# EAGLE design Qwiic_keypad (EAGLE 9.2.2)
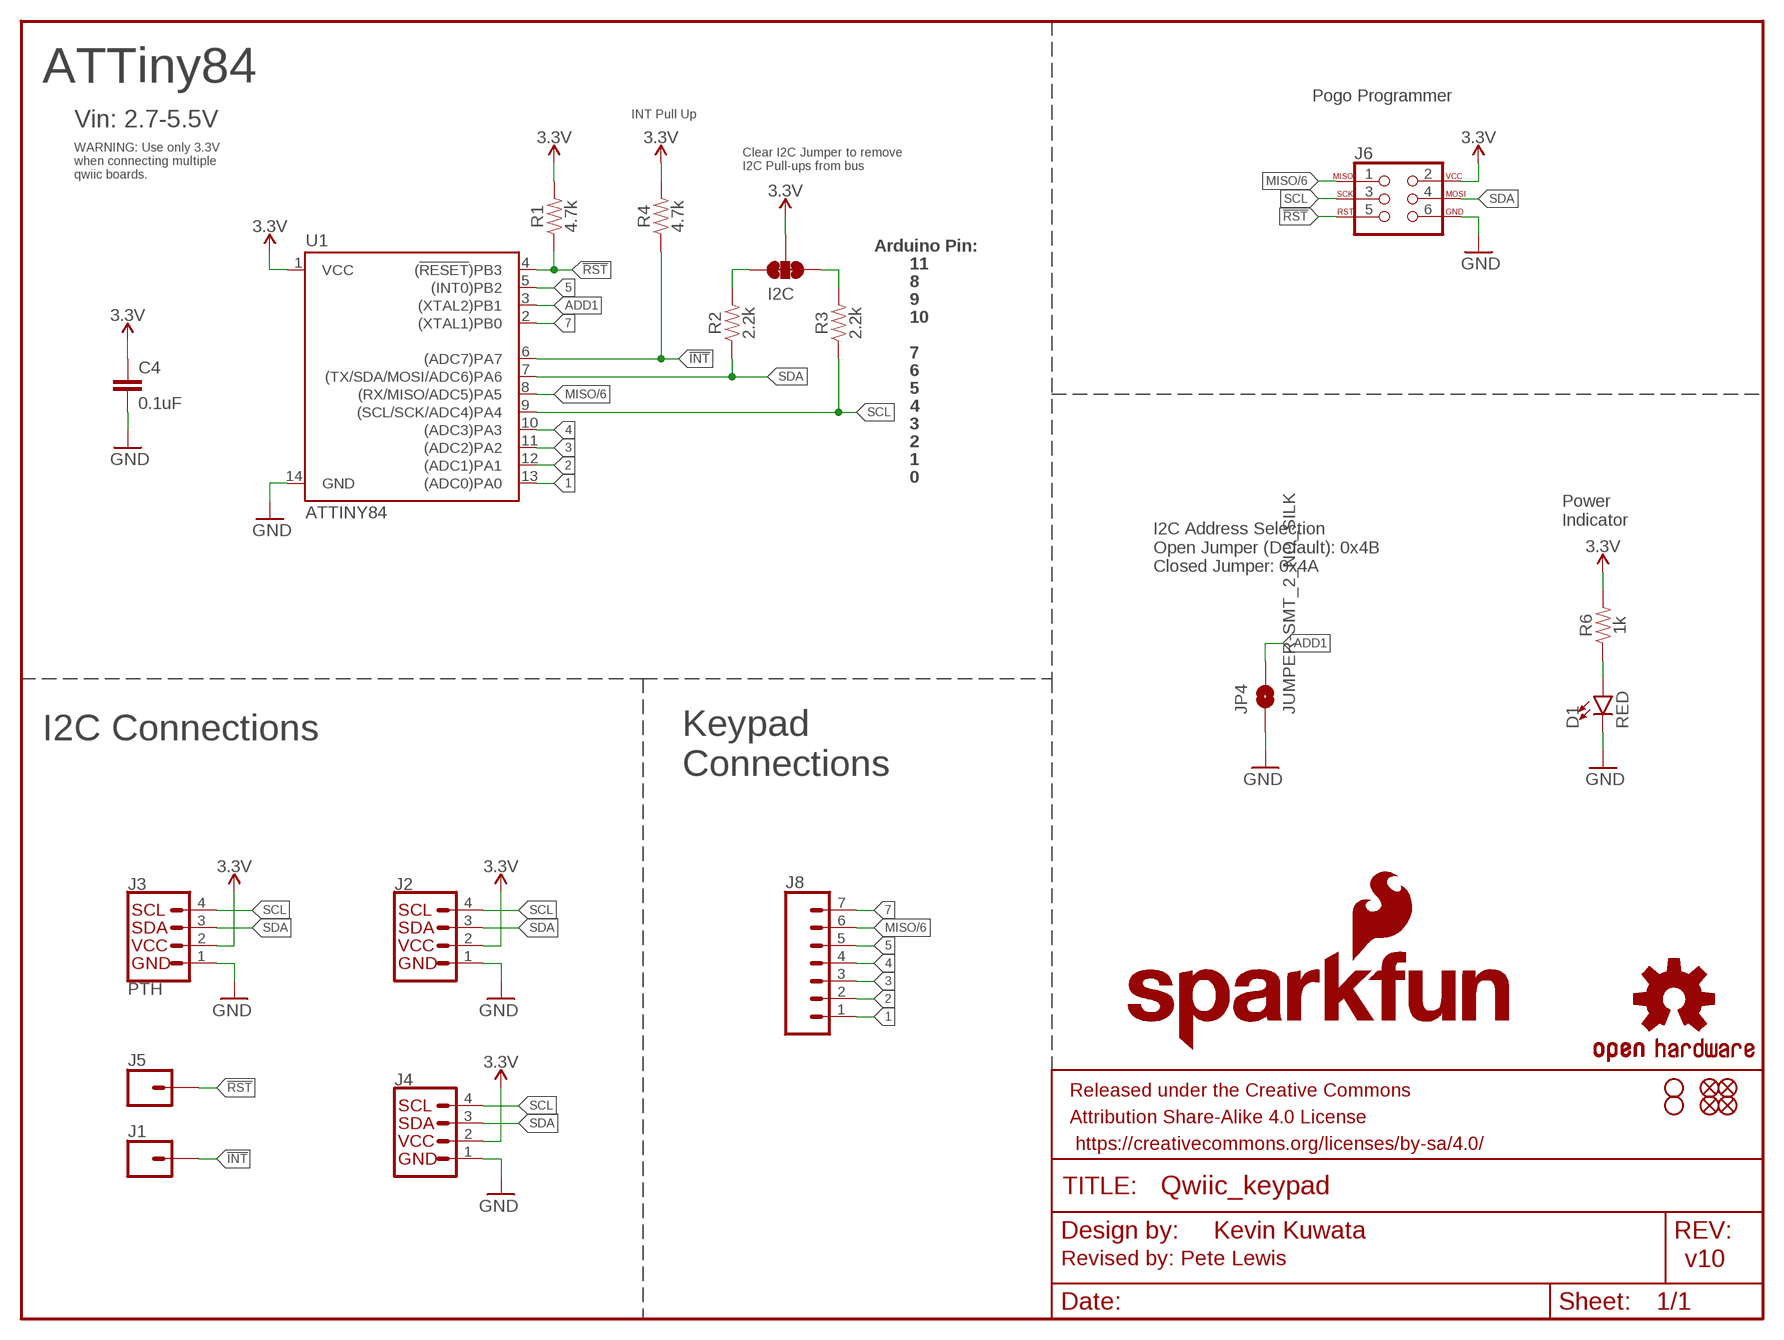
[diagram p0: schematic, sheet 1]

## Parts
C4  0.1uF  0.1UF-0603-25V-(+80/-20%)  [0603]
D1  RED  LED-RED0603  [LED-0603]
FRAME1  FRAME-LETTER  [CREATIVE_COMMONS]
H1  STAND-OFF  [STAND-OFF]
H2  STAND-OFF  [STAND-OFF]
I2C  JUMPER-SMT_3_2-NC_TRACE_SILK  [SMT-JUMPER_3_2-NC_TRACE_SILK]
J1  CONN_01PTH_NO_SILK_YES_STOP  [1X01_NO_SILK]
J2  QWIIC_CONNECTORJS-1MM  [JST04_1MM_RA]
J3  PTH  I2C_STANDARD_NO_SILK  [1X04_NO_SILK]
J4  QWIIC_CONNECTORJS-1MM  [JST04_1MM_RA]
J5  CONN_01PTH_NO_SILK_YES_STOP  [1X01_NO_SILK]
J6  AVR_SPI_PROG_3X2TESTPOINTS  [2X3_TEST_POINTS]
J8  CONN_07LOCK_NO_SILK  [1X07_LOCK_NO_SILK]
JP1  FIDUCIALUFIDUCIAL  [MICRO-FIDUCIAL]
JP2  FIDUCIALUFIDUCIAL  [MICRO-FIDUCIAL]
JP3  FIDUCIALUFIDUCIAL  [MICRO-FIDUCIAL]
JP4  JUMPER-SMT_2_NO_SILK  [SMT-JUMPER_2_NO_SILK]
JP6  FIDUCIALUFIDUCIAL  [MICRO-FIDUCIAL]
LOGO1  OSHW-LOGOMINI  [OSHW-LOGO-MINI]
LOGO2  SFE_LOGO_NAME_FLAME.1_INCH  [SFE_LOGO_NAME_FLAME_.1]
LOGO3  SFE_LOGO_FLAME.2_INCH  [SFE_LOGO_FLAME_.2]
R1  4.7k  4.7KOHM-0603-1/10W-1%  [0603]
R2  2.2k  2.2KOHM-0603-1/10W-1%  [0603]
R3  2.2k  2.2KOHM-0603-1/10W-1%  [0603]
R4  4.7k  4.7KOHM-0603-1/10W-1%  [0603]
R6  1k  1KOHM-0603-1/10W-1%  [0603]
U1  ATTINY84  [SO14]

## Nets
1: J8.1 U1.13((ADC0)PA0)
2: J8.2 U1.12((ADC1)PA1)
3: J8.3 U1.11((ADC2)PA2)
3.3V: C4.1 I2C.2 J2.2 J3.2 J4.2 J6.2 R1.2 R4.2 R6.2 U1.1(VCC)
4: J8.4 U1.10((ADC3)PA3)
5: J8.5 U1.5((INT0)PB2)
7: J8.7 U1.2((XTAL1)PB0)
!INT: J1.1 R4.1 U1.6((ADC7)PA7)
!RST: J5.1 J6.5 R1.1 U1.4((!RESET!)PB3)
ADD1: JP4.2 U1.3((XTAL2)PB1)
GND: C4.2 D1.C J2.1 J3.1 J4.1 J6.6 JP4.1 U1.14(GND)
MISO/6: J6.1 J8.6 U1.8((RX/MISO/ADC5)PA5)
N$1: D1.A R6.1
N$2: I2C.3 R2.2
N$3: I2C.1 R3.2
SCL: J2.4 J3.4 J4.4 J6.3 R3.1 U1.9((SCL/SCK/ADC4)PA4)
SDA: J2.3 J3.3 J4.3 J6.4 R2.1 U1.7((TX/SDA/MOSI/ADC6)PA6)

## Notes on the sheet
- ATTiny84
- Pogo Programmer
- INT Pull Up
- Vin: 2.7-5.5V
- Clear I2C Jumper to remove
  I2C Pull-ups from bus
- WARNING: Use only 3.3V 
  when connecting multiple
  qwiic boards.
- Arduino Pin:
- 11
- 8
- 9
- 10
- 7
- 6
- 5
- 4
- 3
- 2
- 1
- 0
- Power
  Indicator
- I2C Address Selection
  Open Jumper (Default): 0x4B
  Closed Jumper: 0x4A
- I2C Connections
- Keypad 
  Connections
- Kevin Kuwata
- Revised by: Pete Lewis | v10

## Library data of the parts
C4 = SparkFun-Capacitors:0.1UF: 0.1µF ceramic capacitors A capacitor is a passive two-terminal electrical component used to store electrical energy temporarily in an electric field.; PROD_ID: CAP-00810
D1 = SparkFun-LED:LED-RED: Red SMD LED Used in manufacturing of most products at SparkFun Packages: 0603 - SMD 0603 package [Product Link] <http://docs.avagotech.com/docs/AV02-0551EN> 0603 SMART - SMD 0603 SMART package ( more efficient and expensive)[Product Link] <http://www.osram-os.com/Graphics/XPic2/00077099_0.pdf> 1206 - SMD1206 package [Product Link] <https://www.sparkfun.com/datasheets/DevTools/LilyPad/Q150OVS4.pdff> SparkFun Products: Pro Mini 328 -5V <https://www.sparkfun.com/products/821> RedBoard <https://www.sparkfun.com/products/12757> IOIO-OTG <https://www.sparkfun.com/products/13613>; PROD_ID: DIO-00819
FRAME1 = SparkFun-Aesthetics:FRAME-LETTER: Schematic Frame - Letter Standard 8.5x11 US Letter frame
H1 H2 = SparkFun-Hardware:STAND-OFF: Stand Off Drill holes for mechanically mounting via screws, standoffs, etc. Note: Use the keepout ring to avoid running the screw head into surrounding components. Variant Overviews STAND-OFF - Mechanical footprint for a #4 phillips button head screw. STAND-OFF-TIGHT - Mechanical footprint for a #4 phillips button head screw, Example SparkFun Products Screw - Phillips Head (1/4", 4-40, 10 pack) <https://www.sparkfun.com/products/10453> (PRT-10453) Screw - Phillips Head (1/2", 4-40, 10 pack) <https://www.sparkfun.com/products/10452> (PRT-10452) Screw - Phillips Head (3/4", 4-40, 10 pack) <https://www.sparkfun.com/products/10451> (PRT-10451) Screw - Phillips Head (1", 4-40, 10 pack) <https://www.sparkfun.com/products/10450> (PRT-10450)
I2C = SparkFun-Jumpers:JUMPER-SMT_3_2-NC_TRACE: Normally closed trace jumper (2 of 2 connections) This jumper has a trace between all three pads so they are normally closed (NC). Use a razor knife to open the connection(s). For best results follow the IPC guidelines for cutting traces: Cutout at least 0.063 mm (0.005 in). Remove all loose material to clean up the cut area. Seal the cut with an approved epoxy. Reapply solder to reclose the connection(s).
J1 J5 = SparkFun-Connectors:CONN_01: Single connection point. Often used as Generic Header-pin footprint for 0.1 inch spaced/style header connections On any of the 0.1 inch spaced packages, you can populate with these: Break Away Headers - Straight <https://www.sparkfun.com/products/116> (PRT-00116) Break Away Male Headers - Right Angle <https://www.sparkfun.com/products/553> (PRT-00553) Female Headers <https://www.sparkfun.com/products/115> (PRT-00115) Break Away Headers - Machine Pin <https://www.sparkfun.com/products/117> (PRT-00117) Break Away Female Headers - Swiss Machine Pin <https://www.sparkfun.com/products/743> (PRT-00743) This device is also useful as a general connection point to wire up your design to another part of your project. Our various solder wires solder well into these plated through hole pads. Hook-Up Wire - Assortment (Stranded, 22 AWG) <https://www.sparkfun.com/products/11375> (PRT-11375) Hook-Up Wire - Assortment (Solid Core, 22 AWG) <https://www.sparkfun.com/products/11367> (PRT-11367) View the entire wire category on our website here <https://www.sparkfun.com/categories/141> Special notes: SMTSO-256-ET is a "flush mount" nut for a 4-40 screw. We mostly use this on specialty testbeds; it is a nice way to connect hardware to your PCB at an adjustable hieght. Also note, the SNAP packages are for using a snappable style connector. We sell a baggie of snaps and they are also used on two LilyPad designs: Snap Assortment - 30 pack (male and female) <https://www.sparkfun.com/products/11347> (DEV-11347) LilyPad Arduino SimpleSnap <https://www.sparkfun.com/products/10941> (DEV-10941) LilyPad SimpleSnap Protoboard <https://www.sparkfun.com/products/10940> (DEV-10940)
J2 J4 = SparkFun-Connectors:QWIIC_CONNECTOR: SparkFun I2C Standard Qwiic Connector An SMD 1mm pitch JST connector makes it easy and quick (get it? Qwiic?) to connect I2C devices to each other. The Qwiic system <http://www.sparkfun.com/qwiic> enables fast and solderless connection between popular platforms and various sensors and actuators. We carry 200mm <https://www.sparkfun.com/products/14204>, 100mm <https://www.sparkfun.com/products/14205>, 50mm <https://www.sparkfun.com/products/14206>, and breadboard friendly <https://www.sparkfun.com/products/14207> Qwiic cables. We also offer 10 pcs strips <https://www.sparkfun.com/products/14323> the SMD connectors.; PROD_ID: CONN-13694
J3 = SparkFun-Connectors:I2C_STANDARD: SparkFun I2C Standard Pinout Header SparkFun has standardized on a pinout for all I2C based sensor breakouts. This pinout allows I2C boards to be plugged directly into the headers on Arduino Uno compatible boards, and to be daisy chained easily. Example SparkFun Products: SparkFun Atmospheric Sensor Breakout - BME280 <https://www.sparkfun.com/products/13676> SparkFun Altitude/Pressure Sensor Breakout - MPL3115A2 <https://www.sparkfun.com/products/11084> SparkFun TOF Range Finder Sensor - VL6180 <https://www.sparkfun.com/products/12785>
J6 = SparkFun-Connectors:AVR_SPI_PROG_3X2: AVR ISP 6 Pin This is the reduced ISP connector for AVR programming. Common on Arduino. This footprint will take up less PCB space and can be used with a 10-pin to 6-pin adapter such as SKU: BOB-08508 **Special note about "TEST_POINT" package. The stop mask is on the top side, so if you want your programming test points to be on the bottom of your board, make sure to place this package on the bottom side of the board. This also ensure that the orientation to program from the bottom side will be correct. SparkFun Products: SparkFun ISP Pogo Adapter <https://www.sparkfun.com/products/11591> - NS Tiny AVR Programmer <https://www.sparkfun.com/products/11801> -PTH
J8 = SparkFun-Connectors:CONN_07: Multi connection point. Often used as Generic Header-pin footprint for 0.1 inch spaced/style header connections On any of the 0.1 inch spaced packages, you can populate with these: Break Away Headers - Straight <https://www.sparkfun.com/products/116> (PRT-00116) Break Away Male Headers - Right Angle <https://www.sparkfun.com/products/553> (PRT-00553) Female Headers <https://www.sparkfun.com/products/115> (PRT-00115) Break Away Headers - Machine Pin <https://www.sparkfun.com/products/117> (PRT-00117) Break Away Female Headers - Swiss Machine Pin <https://www.sparkfun.com/products/743> (PRT-00743) For SCREWTERMINALS and SPRING TERMINALS visit here: Screw Terimnals on SparkFun.com <https://www.sparkfun.com/search/results?term=Screw+Terminals> (5mm/3.5mm/2.54mm spacing) This device is also useful as a general connection point to wire up your design to another part of your project. Our various solder wires solder well into these plated through hole pads. Hook-Up Wire - Assortment (Stranded, 22 AWG) <https://www.sparkfun.com/products/11375> (PRT-11375) Hook-Up Wire - Assortment (Solid Core, 22 AWG) <https://www.sparkfun.com/products/11367> (PRT-11367) View the entire wire category on our website here <https://www.sparkfun.com/categories/141> Special notes: Molex polarized connector foot print use with SKU : PRT-08231 with associated crimp pins and housings. 1MM SMD Version SKU: PRT-10208 NOTES ON THE VARIANTS LOCK and LOCK_LONGPADS... This footprint was designed to help hold the alignment of a through-hole component (i.e. 6-pin header) while soldering it into place. You may notice that each hole has been shifted either up or down by 0.005 of an inch from it's more standard position (which is a perfectly straight line). This slight alteration caused the pins (the squares in the middle) to touch the edges of the holes. Because they are alternating, it causes a "brace" to hold the component in place. 0.005 has proven to be the perfect amount of "off-center" position when using our standard breakaway headers. Although looks a little odd when you look at the bare footprint, once you have a header in there, the alteration is very hard to notice. Also,if you push a header all the way into place, it is covered up entirely on the bottom side.
JP1-JP3 JP6 = SparkFun:FIDUCIAL: Fiducial Alignment Points Various fiducial points for machine vision alignment.
JP4 = SparkFun-Jumpers:JUMPER-SMT_2_NO: Normally open jumper This jumper has two pads in close proximity to each other. Apply solder to close the connection. Round pads are easier to solder for beginners, but are a lot larger. SparkFun Product that uses the round pads: SparkFun EL Sequencer <https://www.sparkfun.com/products/12781>
LOGO1 = SparkFun-Aesthetics:OSHW-LOGO: Open-Source Hardware (OSHW) Logo This logo indicates the piece of hardware it is found on incorporates a OSHW license and/or adheres to the definition of open source hardware found here: http://freedomdefined.org/OSHW
LOGO2 = SparkFun-Aesthetics:SFE_LOGO_NAME_FLAME: SparkFun Font Logo w/ Flame This is the SparkFun full logo. The logo on the schematic will always be the same size; the package variant is the height of the flame part of the logo. Default layer for the logo on the board is tSilk.
LOGO3 = SparkFun-Aesthetics:SFE_LOGO_FLAME: SparkFun Flame Logo This is the SparkFun flame logo. The logo on the schematic will always be the same size; the package variant is the height of the flame. Default layer for the logo on the board is tSilk.
R1 R4 = SparkFun-Resistors:4.7KOHM: 4.7kΩ resistor A resistor is a passive two-terminal electrical component that implements electrical resistance as a circuit element. Resistors act to reduce current flow, and, at the same time, act to lower voltage levels within circuits. - Wikipedia; PROD_ID: RES-07857
R2 R3 = SparkFun-Resistors:2.2KOHM: 2.2kΩ resistor A resistor is a passive two-terminal electrical component that implements electrical resistance as a circuit element. Resistors act to reduce current flow, and, at the same time, act to lower voltage levels within circuits. - Wikipedia; PROD_ID: RES-08272
R6 = SparkFun-Resistors:1KOHM: 1kΩ resistor A resistor is a passive two-terminal electrical component that implements electrical resistance as a circuit element. Resistors act to reduce current flow, and, at the same time, act to lower voltage levels within circuits. - Wikipedia; PROD_ID: RES-07856
U1 = SparkFun-IC-Microcontroller:ATTINY84: Atmel 14-pin 2/4/8kB flash uC Datasheet <https://cdn.sparkfun.com/datasheets/Widgets/doc8006.pdf> SparkFun Products Tiny AVR Programmer <https://www.sparkfun.com/products/11801> (PGM-11801) SparkFun Servo Trigger - Continuous Rotation <https://www.sparkfun.com/products/13872> (WIG-13872) SparkFun Servo Trigger <https://www.sparkfun.com/products/13118> (WIG-13118); PROD_ID: IC-11285

## Board
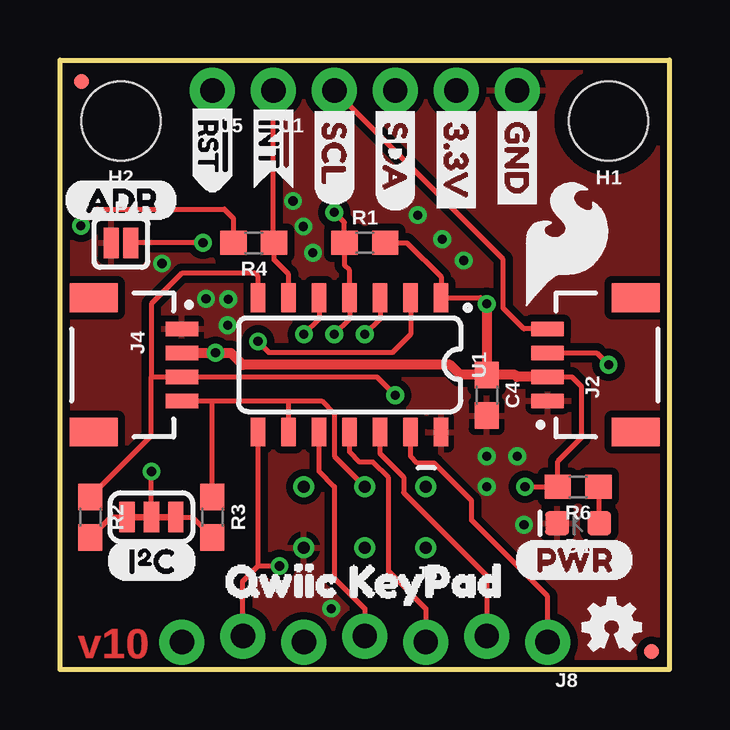
[diagram p1: board, top side]
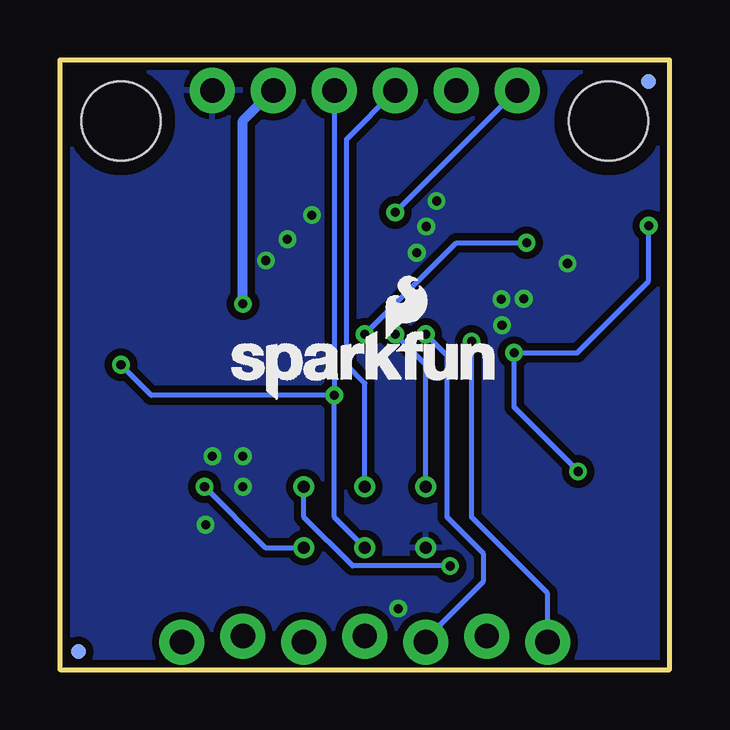
[diagram p2: board, bottom side, seen from below]

Size 25.4 x 25.4 mm. Coordinates in mm from the lower left corner, seen from the top.
Outline: 25.4,0 0,0 0,25.4 25.4,25.4 25.4,0
Copper layers (1*16): Top 0.035mm / dielectric 1.5mm / Bottom 0.035mm
Design rules "SparkFun-2-layer-TIGHT": minimum track width 7mil, minimum drill 15mil, track to track 7mil, track to pad 7mil, pad to pad 7mil, via to via 7mil, smd to smd 7mil, copper to edge 7mil, drill to drill 7mil, minimum pad ring 7mil, minimum via ring 7mil, stop-mask expansion 4mil, vias tented up to drill 25mil, thermal gap 10mil

### Footprints (pad centres in the part's own frame; a part is rotated, then mirrored left to right if it is on the bottom)
0603 = smd 1.1 x 1: 1 -0.85,0; 2 0.85,0
LED-0603 = smd 1 x 1: A -0.877,0; C 0.877,0
STAND-OFF = hole 3.302: 0,0
SMT-JUMPER_3_2-NC_TRACE_SILK = smd 0.635 x 1.27: 1 -1.016,0; 2 0,0; 3 1.016,0
1X01_NO_SILK = drill 1.016 pad 1.88: 1 0,0
JST04_1MM_RA = smd 0.6 x 1.35: 1 -1.5,0; 2 -0.5,0; 3 0.5,0; 4 1.5,0 | smd 1.2 x 2: NC1 2.8,-3.675; NC2 -2.8,-3.675
1X04_NO_SILK = drill 1.016 pad 1.88: 1 0,0; 2 2.54,0; 3 5.08,0; 4 7.62,0
2X3_TEST_POINTS = drill 0.508: 1 -2.54,-1.27; 2 -2.54,1.27; 3 0,-1.27; 4 0,1.27; 5 2.54,-1.27; 6 2.54,1.27
1X07_LOCK_NO_SILK = drill 1.016 pad 1.88: 1 0,0.127; 2 2.54,-0.127; 3 5.08,0.127; 4 7.62,-0.127; 5 10.16,0.127; 6 12.7,-0.127; 7 15.24,0.127
MICRO-FIDUCIAL = smd 0.635 x 0.635: 1 0,0
SMT-JUMPER_2_NO_SILK = smd 0.635 x 1.27: 1 -0.406,0; 2 0.406,0
SO14 = smd 0.6 x 1.2: 1 -3.175,-2.8; 2 -1.905,-2.8; 3 -0.635,-2.8; 4 0.635,-2.8; 5 1.905,-2.8; 6 3.175,-2.8; 7 4.445,-2.8; 8 4.445,2.8; 9 3.175,2.8; 10 1.905,2.8; 11 0.635,2.8; 12 -0.635,2.8; 13 -1.905,2.8; 14 -3.175,2.8

### Placement (x,y rotation side)
C4  17.78,11.43 270 top
D1  21.59,6.1 180 top
FRAME1  -13.97,-11.43 0 top  (outside the outline)
H1  22.86,22.86 180 top
H2  2.54,22.86 180 top
I2C  3.81,6.35 180 top
J1  8.89,24.13 180 top
J2  20.32,12.7 90 top
J3  19.05,24.13 180 top
J4  5.08,12.7 270 top
J5  6.35,24.13 180 top
J6  12.7,6.35 180 top
J8  20.32,1.27 180 top
JP1  0.89,24.51 180 bottom
JP2  0.89,24.51 180 top
JP3  24.64,0.76 180 bottom
JP4  2.54,17.78 0 top
JP6  24.64,0.76 180 top
LOGO1  22.99,1.78 0 top
LOGO2  12.7,12.7 0 bottom
LOGO3  21.12,17.7 0 top
R1  12.7,17.78 0 top
R2  1.27,6.35 270 top
R3  6.35,6.35 270 top
R4  8.07,17.78 180 top
R6  21.59,7.62 180 top
U1  12.7,12.7 180 top
U$3  [3.3V]  16.51,23.75 270 top
U$4  [GND]  19.05,23.75 270 top
U$5  [SDA]  13.97,23.75 270 top
U$6  [SCL]  11.43,23.75 270 top
U$8  [(PWR)]  18.92,4.57 0 top
U$9  [(I_SUPER2_C)]  1.92,4.52 0 top
U$10  [(ADR)]  0.13,19.56 0 top
U$11  [#RST>]  6.35,24 270 top
U$12  [#INT1]  8.89,24 270 top
U$15  [QWIIC_KEYPAD0]  5.71,3.68 0 top

### Tracks (layer width: path | path; a pad name or v marks a point on that pad's centre or on a via)
1
  Top 0.203: J8.1 20.32,3.05 17.15,6.22 17.15,7.04 15.59,8.61 14.89,8.61 14.61,8.89 U1.13
2
  Top 0.203: J8.2 17.78,3.9 14.31,7.37 14.31,8.02 13.34,9 U1.12
3
  Top 0.203: J8.3 15.24,2.54 13.69,4.09 13.69,7.99 13.04,8.65 12.49,8.65 12.06,9.07 U1.11
3.3V  (via drill 0.38)
  Top 0.203: J2.2 21.33,12.2 21.72,11.81 21.72,9.65 20.74,8.68 R6.2 v19.38,7.62 | v17.78,15.24 17.52,15.5 U1.1 15.88,16.36 14.46,17.78 R1.2 | v0.87,18.49 1.56,19.18 6.84,19.18 7.22,18.8 R4.2 | I2C.2 v3.81,8.26
  Top 0.406: J2.2 19.04,12.2 18.96,12.28 C4.1 | J4.2 v6.48,13.2 7.12,13.2 7.62,12.7 16.26,12.7 16.68,12.28 C4.1 | v17.78,15.24 C4.1
  Bottom 0.203: v3.81,8.26 6.48,10.92 v6.48,13.2 3.86,13.2 0.87,16.18 v0.87,18.49 | v19.38,7.62 16.84,5.08 J6.2
  Bottom 0.406: v17.78,15.24 17.78,22.86 J3.2
4
  Top 0.203: J8.4 12.7,2.54 11.43,3.81 11.43,7.62 10.79,8.26 U1.10
5  (via drill 0.38)
  Top 0.203: v10.16,13.97 10.79,14.61 U1.5
  Bottom 0.203: J8.5 10.16,1.27 7.75,3.68 7.75,4.83 9.27,6.35 9.27,13.08 v10.16,13.97
7  (via drill 0.38)
  Top 0.203: v8.25,13.68 8.72,13.21 13.84,13.21 14.61,13.97 U1.2
  Bottom 0.203: J8.7 5.08,3.17 8.25,6.34 v8.25,13.68
!INT
  Top 0.203: J1.1 8.89,17.82 R4.1 8.93,17.07 9.53,16.47 U1.6
!RST  (via drill 0.38)
  Top 0.203: v11.43,19.05 11.85,18.63 R1.1 11.85,16.85 12.06,16.64 U1.4 12.06,14.61 v11.43,13.97
  Bottom 0.203: J5.1 v11.43,19.05 | J6.5 10.16,12.7 v11.43,13.97
ADD1  (via drill 0.38)
  Top 0.203: v5.96,17.79 JP4.2 | v12.7,13.97 13.34,14.61 U1.3
  Bottom 0.203: v12.7,13.97 8.88,17.79 v5.96,17.79
GND  (via drill 0.38)
  other vias: 17.78,8.89 11.3,2.54 4.25,16.92 6.99,14.35 9.71,19.52 15.93,17.93 19.33,6.03 19.05,8.89 17.78,7.62 7.01,15.43 6.08,15.45 16.82,17.04 14.9,18.94 10.14,18.46 10.54,17.37
  pour Bottom (isolate 0.305): 25.4,25.4 25.4,0 0,0 0,25.4
  pour Top (isolate 0.305): 25.4,25.4 25.4,0 0,0 0,25.4
MISO/6  (via drill 0.38)
  Top 0.203: J8.6 7.62,3.68 8.26,4.32 | 8.26,4.32 v9.14,4.32 | 8.26,4.32 U1.8
  Bottom 0.203: J6.1 15.24,6.35 13.21,4.32 v9.14,4.32
N$1
  Top 0.203: R6.1 22.44,6.12 D1.A
N$2
  Top 0.203: R2.2 2.12,6.35 I2C.3
N$3
  Top 0.203: R3.2 5.5,6.35 I2C.1
SCL
  Top 0.203: J4.4 6.35,11.2 | 6.35,11.2 9.53,11.2 | 9.53,11.2 10.9,11.2 11.43,10.67 11.43,8.89 J6.3 | J3.4 18.47,17.09 18.47,15.06 19.33,14.2 J2.4 | R3.1 6.35,11.2 | U1.9 9.53,11.2
  Bottom 0.203: J6.3 12.7,11.94 13.46,12.7 13.46,22.1 J3.4
SDA  (via drill 0.38)
  Top 0.203: 3.81,12.19 J4.3 13.2,12.2 v13.97,11.43 | J2.3 22.36,13.2 v22.86,12.7 | 3.81,12.19 3.81,15.24 5.08,16.51 8.13,16.51 8.26,16.38 U1.7 | R2.1 3.81,9.74 3.81,12.19
  Bottom 0.203: J6.4 13.97,6.35 v13.97,11.43 | v13.97,11.43 21.59,11.43 v22.86,12.7 | J3.3 v13.97,11.43

### Text on the board
Top: v10
tDocu: Kevin Kuwata | Revised by: Pete Lewis